# Altium schematic sheet Analog.SchDoc
size A4; DocumentNumber: 1; SheetNumber: 1
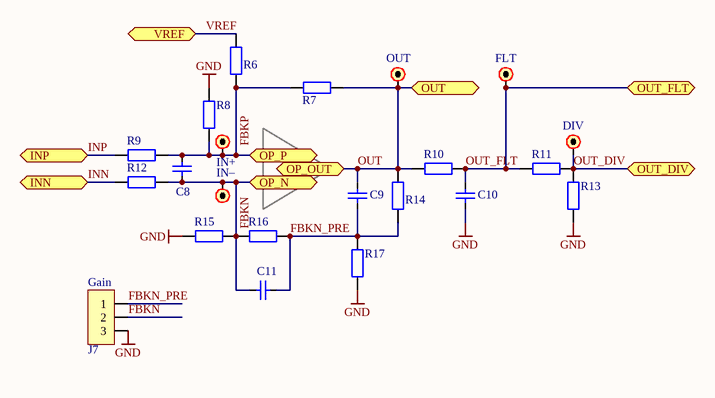
[diagram p0: Analog.SchDoc]

## Parts
C8  ? F  [0805C_RF_M]  (value not drawn)
C9  ? F  [0805C_RF_M]  (value not drawn)
C10  ? F  [0805C_RF_M]  (value not drawn)
C11  ? F  [0805C_RF_M]  (value not drawn)
J7  Gain  [HEADER-2.54-3P1]
R6  ? R  [0805R_RF_M]  (value not drawn)
R7  ? R  [0805R_RF_M]  (value not drawn)
R8  ? R  [0805R_RF_M]  (value not drawn)
R9  ? R  [0805R_RF_M]  (value not drawn)
R10  ? R  [0805R_RF_M]  (value not drawn)
R11  ? R  [0805R_RF_M]  (value not drawn)
R12  ? R  [0805R_RF_M]  (value not drawn)
R13  ? R  [0805R_RF_M]  (value not drawn)
R14  ? R  [0805R_RF_M]  (value not drawn)
R15  ? R  [0805R_RF_M]  (value not drawn)
R16  ? R  [0805R_RF_M]  (value not drawn)
R17  ? R  [0805R_RF_M]  (value not drawn)
TP5  OUT  [PAD_R_1.5MM]
TP6  FLT  [PAD_R_1.5MM]
TP7  DIV  [PAD_R_1.5MM]
TP8  IN+  [PAD_R_1.5MM]
TP9  IN–  [PAD_R_1.5MM]

## Ports
INN, INP, OP_N, OP_OUT, OP_P, OUT, OUT_DIV, OUT_FLT, VREF

## Nets
GND: C10.1 J7.3 R8.2 R13.1 R15.1 R17.1
FBKN: C8.2 C11.2 J7.2 R12.2 R15.2 R16.1 TP9.1 ; port OP_N
FBKN_PRE: C9.1 C11.1 J7.1 R14.1 R16.2 R17.2
FBKP: C8.1 R6.2 R7.2 R8.1 R9.1 TP8.1 ; port OP_P
INN: R12.1 ; port INN
INP: R9.2 ; port INP
OUT: C9.2 R7.1 R10.1 R14.2 TP5.1 ; port OUT, port OP_OUT
OUT_DIV: R11.2 R13.2 TP7.1 ; port OUT_DIV
OUT_FLT: C10.2 R10.2 R11.1 TP6.1 ; port OUT_FLT
VREF: R6.1 ; port VREF

## Notes on the sheet
- Author
- Date
- Revision
- Size
- A4
- Sheet
- of

## Library data of the parts
C8-C11 = C: Capacitor; Manufacturer: Generic Brand; Max Voltage: ? V; Value: ? F; Tolerance: ?; Mounting Technology: SMT; Tag: *; Manufacturer Part No: *; Supplier: *; Supplier Link: http://; Supplier Part No: *; Category: Capacitor
J7 = PINHDR-3P1: Generic Pin Header 3x1
R6-R17 = R: Resistor; Manufacturer: Generic Brand; Power Rating: ? W; Max Voltage: ? V; Value: ? R; Tolerance: ?; Supplier Link: http://; Category: Resistor; Mounting Technology: SMT
TP5-TP9 = Test Point: Test Point / Pad